# EasyEDA Pro project ProDocument_CSPS-ATX12VO-NAK12S20_2023-09-14.epro

# Schematic Schematic-NAK12S20
Create Date: 2023-08-24; Page Name: P1; Project Name: CSPS_DCATX; Schematic Name: Schematic-NAK12S20; Update Date: 2023-08-29; Page Size: A3; Version: V1.0
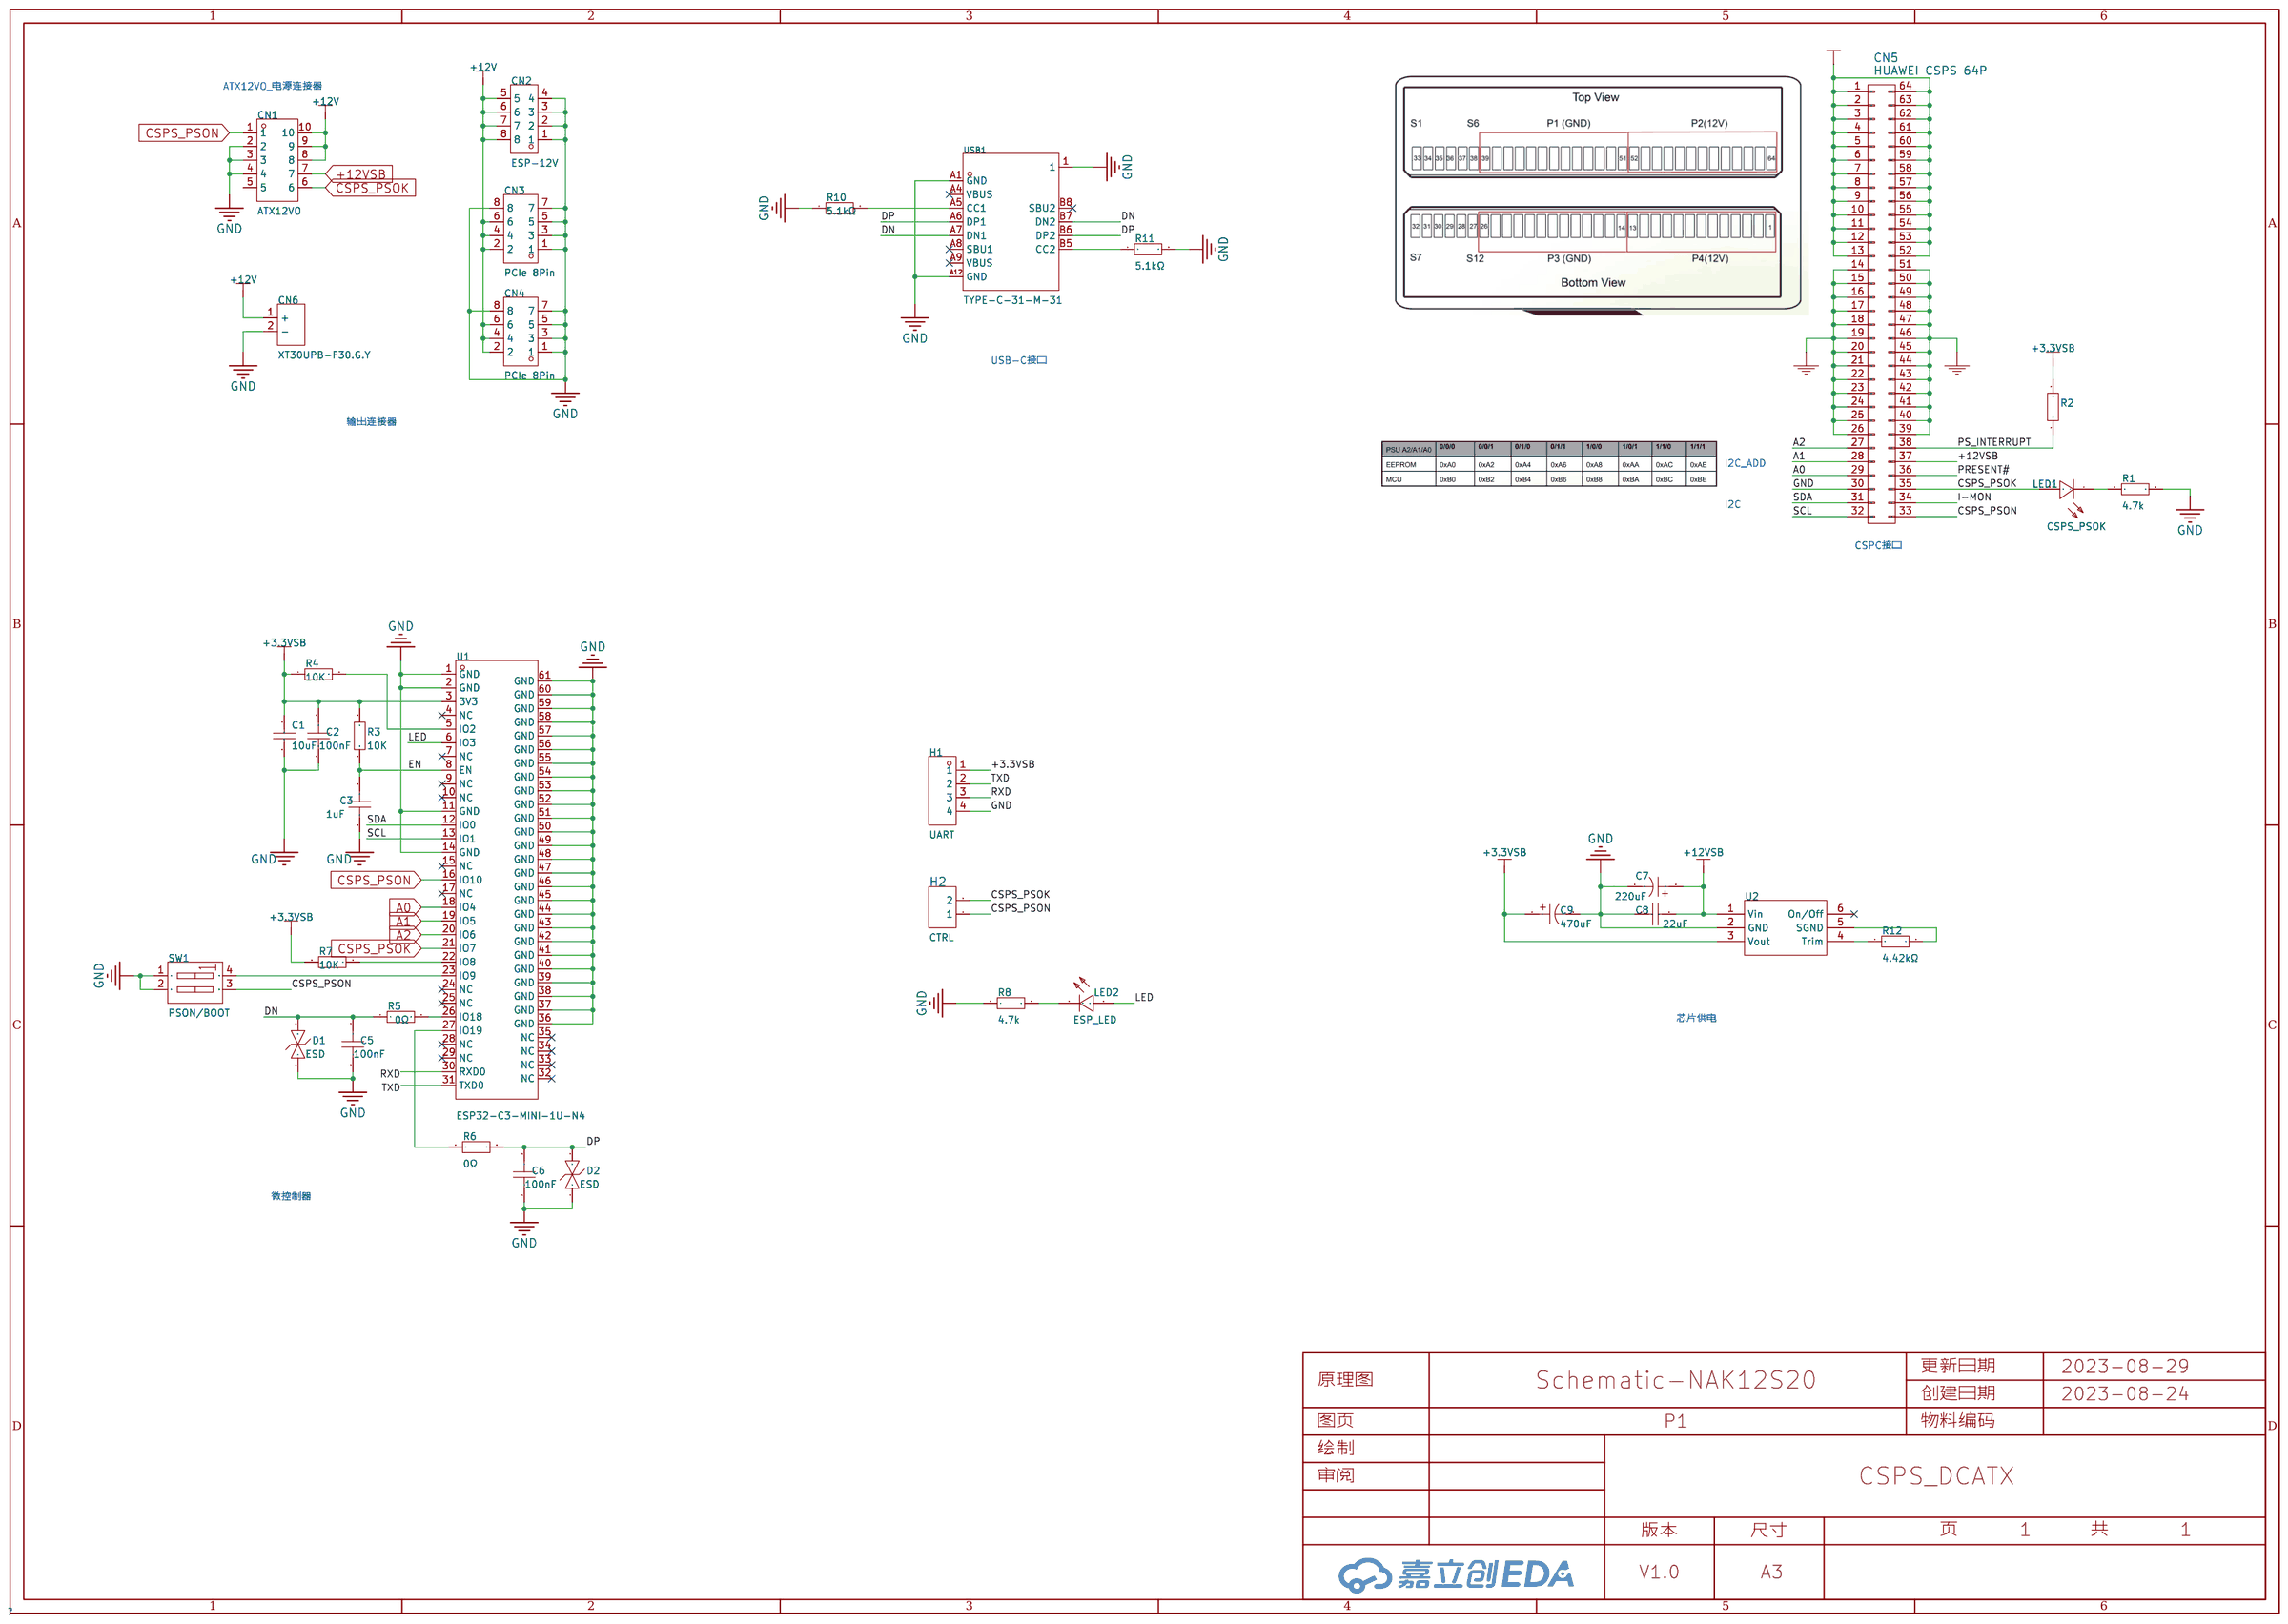
[diagram p0: schematic sheet]

## Parts
C1  10uF  [C0805]
C2  100nF  [C0603]
C3  1uF  [C0603]
C5  100nF  [C0603]
C6  100nF  [C0603]
C7  220uF  [CAP-SMD_BD6.3-L6.6-W6.6-FD]
C8  22uF  [C1206]
C9  470uF  [CAP-SMD_BD8.0-L8.3-W8.3-LS9.0-FD]
CN1  ATX12VO  [CONN-TH_X9357WV-2-05-N2SN]
CN2  ESP-12V  [CONN-TH_39288080]
CN3  PCIe 8Pin  [CONN-TH_8P-P4.20_CST_CS-1150-08D]
CN4  PCIe 8Pin  [CONN-TH_8P-P4.20_CST_CS-1150-08D]
CN5  HUAWEI CSPS 64P  [ATX 64P HP 野口64P直插]
CN6  XT30UPB-F30.G.Y  [CONN-TH_XT30UPB-F]
D1  ESD  [SOD-882_L1.0-W0.6-BI]
D2  ESD  [SOD-882_L1.0-W0.6-BI]
H1  UART  [HDR-TH_4P-P2.54-V-F]
H2  CTRL  [HDR-TH_2P-P2.54-V-F]
LED1  CSPS_PSOK  [LED0603-RD_GREEN]
LED2  ESP_LED  [LED0603-RD]
R1  4.7k  [R0603]
R2  4.7k  [R0603]
R3  10K  [R0603]
R4  10K  [R0603]
R5  0Ω  [R0603]
R6  0Ω  [R0603]
R7  10K  [R0603]
R8  4.7k  [R0603]
R10  5.1kΩ  [R0603]
R11  5.1kΩ  [R0603]
R12  4.42kΩ  [R0603]
SW1  PSON/BOOT  [SW-SMD_4P-L6.0-W5.1-P2.54-LS9.3-BL]
U1  ESP32-C3-MINI-1U-N4  [WIFIM-SMD_61P-L13.2-W12.5-P0.80]
U2  -  [NAK12S20-C]
USB1  TYPE-C-31-M-31  [USB-C-SMD_TYPE-C-31-M-31]

## Library data of the parts
C1 = CL21A106KAYNNNE_C15850: 容值:10uF;精度:±10%;额定电压:25V;材质(温度系数):X5R;; LCSC Part Name: 10uF ±10% 25V; Supplier Part: C15850; Manufacturer: SAMSUNG(三星); Manufacturer Part: CL21A106KAYNNNE; Supplier Footprint: 0805; JLCPCB Part Class: 基础库; Datasheet: https://atta.szlcsc.com/upload/public/pdf/source/20160103/1457707679302.pdf; Supplier: LCSC; Tolerance: ±10%; Voltage Rated: 25V; Temperature Coefficient: X5R
C2 C3 C5 C6 = CAP_0603: Supplier Footprint: 0603
C7 = RVT220UF16V67RV0015: 容值:220uF;精度:±20%;额定电压:16V;纹波电流:110mA@120Hz;等效串联电阻:-;; LCSC Part Name: 220uF ±20% 16V; Supplier Part: C2887273; Manufacturer: KNSCHA(科尼盛); Supplier Footprint: SMD,D6.3xL7.7mm; JLCPCB Part Class: 扩展库; Datasheet: https://atta.szlcsc.com/upload/public/pdf/source/20210824/3DC9999D9B098FE241E3A26137981C4C.pdf; Supplier: LCSC; Tolerance: ±20%; Rated Voltage: 16V; φD: 6.3mm; L: 7.7mm; Ripple Current: 110mA@120Hz; Lifetime @ Temp: 2000hrs@105℃; Operating Temperature: -55℃~+105℃
C8 = CL31A226KAHNNNE: 容值:22uF;精度:±10%;额定电压:25V;材质(温度系数):X5R;; LCSC Part Name: 22uF ±10% 25V; Supplier Part: C12891; Manufacturer: SAMSUNG(三星); Supplier Footprint: 1206; JLCPCB Part Class: 基础库; Datasheet: https://atta.szlcsc.com/upload/public/pdf/source/20160103/1457707667836.pdf; Supplier: LCSC; Tolerance: ±10%; Voltage Rated: 25V; Temperature Coefficient: X5R
C9 = RVT470UF16V67RV0031: 容值:470uF;额定电压:16V;工作寿命:2000hrs@105℃;; LCSC Part Name: 470uF 16V; Supplier Part: C2858857; Manufacturer: KNSCHA(科尼盛); Supplier Footprint: SMD,8x10.2mm; JLCPCB Part Class: 扩展库; Supplier: LCSC; Rated Voltage: 16V; Lifetime @ Temp: 2000hrs@105℃
CN1 = X9357WV-2x05-N2SN: 参考系列:-;间距:4.2mm;插针结构:2x5P;排数:2;每排PIN数:5;行距:4.2mm;公母:母型插口;安装方式:直插;额定电流:9A;触头材质:黄铜;触头镀层:锡;工作温度范围:-25℃~+85℃;焊接温度(最大值):260℃;; LCSC Part Name: 4.2mm 2x5P 直插; Supplier Part: C388774; Manufacturer: XKB Connectivity(中国星坤); Supplier Footprint: 插件,P=4.2mm; JLCPCB Part Class: 扩展库; Datasheet: https://atta.szlcsc.com/upload/public/pdf/source/20200618/C388780_3940A936C4431515C5C8B4FDD63262F5.pdf; Supplier: LCSC; Pitch: 4.2mm; Pins Structure: 2x5P; Number of Rows: 2; Number of PINs Per Row: 5; Row Spacing: 4.2mm; Gender: 母型插口; Mounting Style: 直插; Current Rating (Max): 9A; Contact Material: 黄铜; Contact Plating: 锡; Operating Temperature Range: -25℃~+85℃; Welding Temperature (Max): 260℃
CN2 = 39288080: 参考系列:-;间距:4.2mm;插针结构:2x4P;排数:2;每排PIN数:4;行距:4.2mm;公母:母型插口;安装方式:直插;额定电流:-;工作温度范围:-;; LCSC Part Name: 4.2mm 2x4P 直插; Supplier Part: C505059; Manufacturer: MOLEX; Supplier Footprint: 直插,P=4.2mm; JLCPCB Part Class: 扩展库; Datasheet: https://atta.szlcsc.com/upload/public/pdf/source/20200305/C490534_56FFF6A75141AEB9881ADC289DCEF44C.pdf; Supplier: LCSC; Pitch: 4.2mm; Pins Structure: 2x4P; Number of Rows: 2; Number of PINs Per Row: 4; Row Spacing: 4.2mm; Gender: 母型插口; Mounting Style: 直插
CN3 CN4 = CS-1150-08D: 参考系列:-;间距:4.2mm;插针结构:2x4P;排数:2;每排PIN数:4;行距:4.2mm;公母:母型插口;安装方式:直插;额定电流:7A;工作温度范围:-40℃~+105℃;; LCSC Part Name: 4.2mm 2x4P 直插; Supplier Part: C2886679; Manufacturer: CST(永丰盈); Supplier Footprint: 插件,P=4.2mm; JLCPCB Part Class: 扩展库; Datasheet: https://atta.szlcsc.com/upload/public/pdf/source/20210907/CA36E0C11B96594AB63D77B45F584706.pdf; Supplier: LCSC; Pitch: 4.2mm; Pins Structure: 2x4P; Number of Rows: 2; Number of PINs Per Row: 4; Row Spacing: 4.2mm; Gender: 母型插口; Mounting Style: 直插; Current Rating (Max): 7A; Operating Temperature Range: -40℃~+105℃
CN5 = HP CSPS ATX 64P
CN6 = XT30UPB-F30.G.Y: 模型插头连接器; LCSC Part Name: AMASS(艾迈斯)直立焊板式连接器XT30UPB30-F.G.*; Supplier Part: C108769; Manufacturer: AMASS(艾迈斯); JLCPCB Part Class: 扩展库; Datasheet: https://atta.szlcsc.com/upload/public/pdf/source/20220715/AFD68B9E8B6CA95A7295DBF4AF9325E4.pdf; Supplier: LCSC
D1 D2 = ESD05V88D-LC: 极性:-;反向关断电压（典型值）:5V (Max);击穿电压（最小值）:6V;箝位电压:25V;峰值脉冲电流（10/1000us）:2.5A (8/20us);; Supplier Part: C303803; Manufacturer: SOCAY(硕凯); Supplier Footprint: SOD-882; JLCPCB Part Class: 扩展库; Datasheet: https://atta.szlcsc.com/upload/public/pdf/source/20190214/C303803_4EC156DA2EEF4DE29273DF707B47A120.pdf; Supplier: LCSC; Voltage - Reverse Standoff (Typ): 5V (Max); Voltage - Breakdown (Min): 6V; Voltage - Clamping (Max) @ Ipp: 25V; Current - Peak Pulse (10/1000μs): 2.5A (8/20us)
H1 = HDR-F_2.54_1x4P: Supplier Part: C2718488; Supplier Footprint: 插件
H2 = HDR-F_2.54_1x2P: Supplier Part: C49661; Supplier Footprint: 插件
LED1 = LED-0603G-FZ_GREEN: Supplier Part: C9900007571; Supplier Footprint: LED0603; JLCPCB Part Class: 扩展库; Datasheet: 2022-02-15/306503D/4f9af1fa6f7443e0a55b55c7ec05d279/D-060306G2／SS2／G.pdf; Supplier: LCSC
LED2 = 19-217/GHC-YR1S2/3T: 发光颜色:翠绿;二极管配置:-;主波长:520nm~535nm;色温:-;功率:110mW;安装方式:-;; Supplier Part: C72043; Manufacturer: EVERLIGHT(亿光); Supplier Footprint: 0603; JLCPCB Part Class: 基础库; Datasheet: https://atta.szlcsc.com/upload/public/pdf/source/20160507/1462613613780.pdf; Supplier: LCSC; Emitted Color: 翠绿; Lens Color: 无色透明; Dominant Wavelength: 520nm~535nm; Peak Wavelength: 518nm; Forward Current: 20mA; Power Dissipation: 110mW; Viewing Angle: 120°; Operating Temperature: -40℃~+85℃
R1-R4 R7 R8 = Res_0603: Supplier Footprint: 0603
R5 R6 = 0603WAF0000T5E: 电阻类型:厚膜电阻;阻值:0Ω;精度:±1%;功率:100mW;; LCSC Part Name: 0Ω ±1% 100mW; Supplier Part: C21189; Manufacturer: UNI-ROYAL(厚声); Supplier Footprint: 0603; JLCPCB Part Class: 基础库; Datasheet: https://atta.szlcsc.com/upload/public/pdf/source/20200306/C422600_1E6D84923E4A46A82E41ADD87F860B5C.pdf; Supplier: LCSC; Type: 厚膜电阻; Tolerance: ±1%; Power(Watts): 100mW; Overload Voltage (Max): 75V; Operating Temperature Range: -55℃~+155℃
R10 R11 = 0603WAF5101T5E: 电阻类型:厚膜电阻;阻值:5.1kΩ;精度:±1%;功率:100mW;; LCSC Part Name: 5.1kΩ ±1% 100mW; Supplier Part: C23186; Manufacturer: UNI-ROYAL(厚声); Supplier Footprint: 0603; JLCPCB Part Class: 基础库; Datasheet: https://atta.szlcsc.com/upload/public/pdf/source/20200306/C422600_1E6D84923E4A46A82E41ADD87F860B5C.pdf; Supplier: LCSC; Type: 厚膜电阻; Tolerance: ±1%; Power(Watts): 100mW; Temperature Coefficient: ±100ppm/℃; Overload Voltage (Max): 75V; Operating Temperature Range: -55℃~+155℃
R12 = 0603WAF4421T5E: 电阻类型:厚膜电阻;阻值:4.42kΩ;精度:±1%;功率:100mW;; LCSC Part Name: 4.42kΩ ±1% 100mW; Supplier Part: C23043; Manufacturer: UNI-ROYAL(厚声); Supplier Footprint: 0603; JLCPCB Part Class: 扩展库; Datasheet: https://atta.szlcsc.com/upload/public/pdf/source/20200306/C422600_1E6D84923E4A46A82E41ADD87F860B5C.pdf; Supplier: LCSC; Type: 厚膜电阻; Tolerance: ±1%; Power(Watts): 100mW; Temperature Coefficient: ±100ppm/℃; Overload Voltage (Max): 75V; Operating Temperature Range: -55℃~+155℃
SW1 = DSIC02LSGET: 类型:平拨，凸起式;电路结构:单刀单掷;开关位数:2;引脚间距:2.54mm;颜色:黑色;; LCSC Part Name: 2.54mm 2位高推 拨码开关; Supplier Part: C54949; Manufacturer: YE; Supplier Footprint: SMD-4P,6x5.08mm; JLCPCB Part Class: 扩展库; Datasheet: https://atta.szlcsc.com/upload/public/pdf/source/20150928/1457707425489.pdf; Supplier: LCSC; Type: 平拨，凸起式; Circuit: 单刀单掷; Number of Positions: 2; Lead Pitch: 2.54mm; Color: 黑色
U1 = ESP32-C3-MINI-1U-N4: Supplier Part: C2911374; Manufacturer: ESPRESSIF(乐鑫); Supplier Footprint: SMD,12.5x13.2mm; JLCPCB Part Class: 扩展库; Datasheet: https://atta.szlcsc.com/upload/public/pdf/source/20220602/2F3F799AD033675D9930B69B0B580EA8.pdf; Supplier: LCSC
U2 = NAK12S20-C: 华为降压模块; Manufacturer: HUAWEI; Frequency: 300kHz
USB1 = TYPE-C-31-M-31: 连接器类型:Type-C;标准:-;公母:母座;触点数量:16;端口数量:1;安装方式:卧贴;额定电流 - 电源:5A;工作温度范围:-30℃~+80℃;; LCSC Part Name: Type-C 母座 卧贴; Supplier Part: C2760486; Manufacturer: 韩国韩荣; Supplier Footprint: SMD; JLCPCB Part Class: 扩展库; Supplier: LCSC; Connector Type: Type-C; Gender: 母座; Number of Contacts: 16; Number of Ports: 1; Mounting Style: 卧贴; Current Rating - Power (Max): 5A; Operating Temperature Range: -30℃~+80℃

## Nets
+3.3VSB: C1.2 C2.2 C9.1 H1.1 R2.2 R3.2 R4.1 R7.1 U1.3(3V3) U2.3(Vout)
+12V: CN1.8 CN1.9 CN1.10 CN2.5 CN2.6 CN2.7 CN2.8 CN3.2 CN3.4 CN3.6 CN4.2 CN4.4 CN4.6 CN5.1(Pin) CN5.2(Pin) CN5.3(Pin) CN5.4(Pin) CN5.5(Pin) CN5.6(Pin) CN5.7(Pin) CN5.8(Pin) CN5.9(Pin) CN5.10(Pin) CN5.11(Pin) CN5.12(Pin) CN5.13(Pin) CN5.52(Pin) CN5.53(Pin) CN5.54(Pin) CN5.55(Pin) CN5.56(Pin) CN5.57(Pin) CN5.58(Pin) CN5.59(Pin) CN5.60(Pin) CN5.61(Pin) CN5.62(Pin) CN5.63(Pin) CN5.64(Pin) CN6.1(+)
+12VSB: C7.1 C8.2 CN1.7 CN5.37(+12VSB) U2.1(Vin)
GND: C1.1 C2.1 C3.1 C5.1 C6.1 C7.2 C8.1 C9.2 CN1.2 CN1.3 CN1.4 CN2.1 CN2.2 CN2.3 CN2.4 CN3.1 CN3.3 CN3.5 CN3.7 CN3.8 CN4.1 CN4.3 CN4.5 CN4.7 CN4.8 CN5.14(Pin) CN5.15(Pin) CN5.16(Pin) CN5.17(Pin) CN5.18(Pin) CN5.19(Pin) CN5.20(Pin) CN5.21(Pin) CN5.22(Pin) CN5.23(Pin) CN5.24(Pin) CN5.25(Pin) CN5.26(Pin) CN5.30(CSPS-PSOK) CN5.39(Pin) CN5.40(Pin) CN5.41(Pin) CN5.42(Pin) CN5.43(Pin) CN5.44(Pin) CN5.45(Pin) CN5.46(Pin) CN5.47(Pin) CN5.48(Pin) CN5.49(Pin) CN5.50(Pin) CN5.51(Pin) CN6.2(-) D1.1 D2.1 H1.4 R1.2 R8.1 R10.1 R11.2 SW1.1(A1) SW1.2(A2) U1.1(GND) U1.2(GND) U1.11(GND) U1.14(GND) U1.36(GND) U1.37(GND) U1.38(GND) U1.39(GND) U1.40(GND) U1.41(GND) U1.42(GND) U1.43(GND) U1.44(GND) U1.45(GND) U1.46(GND) U1.47(GND) U1.48(GND) U1.49(GND) U1.50(GND) U1.51(GND) U1.52(GND) U1.53(GND) U1.54(GND) U1.55(GND) U1.56(GND) U1.57(GND) U1.58(GND) U1.59(GND) U1.60(GND) U1.61(GND) U2.2(GND) USB1.1 USB1.A1(GND) USB1.A12(GND)
A0: CN5.29(PRESENT) U1.18(IO4)
A1: CN5.28(+12VSB) U1.19(IO5)
A2: CN5.27(PWOK) U1.20(IO6)
CSPS_PSOK: CN1.6 CN5.35(I2C-GND) H2.2 LED1.2(+) U1.21(IO7)
CSPS_PSON: CN1.1 CN5.33(scl) H2.1 SW1.3(B2) U1.16(IO10)
DN: C5.2 D1.2 R5.1 USB1.A7(DN1) USB1.B7(DN2)
DP: C6.2 D2.2 R6.2 USB1.A6(DP1) USB1.B6(DP2)
EN: C3.2 R3.1 U1.8(EN)
I-MON: CN5.34(sda)
LED: LED2.2(A) U1.6(IO3)
PRESENT#: CN5.36(PRESENT)
PS_INTERRUPT: CN5.38(pin) R2.1
RXD: H1.3 U1.30(RXD0)
SCL: CN5.32(CSPS-PSON) U1.13(IO1)
SDA: CN5.31(Pin) U1.12(IO0)
TXD: H1.2 U1.31(TXD0)
$1N1591: LED1.1(-) R1.1
$1N2923: R4.2 U1.5(IO2)
$1N3210: R5.2 U1.26(IO18)
$1N3353: R7.2 U1.22(IO8)
$1N3418: SW1.4(B1) U1.23(IO9)
$1N4889: LED2.1(C) R8.2
$1N5330: R10.2 USB1.A5(CC1)
$1N5590: R11.1 USB1.B5(CC2)
$1N6425: R6.1 U1.27(IO19)
$1N20449: R12.1 U2.4(Trim)
$1N20452: R12.2 U2.5(SGND)

Not connected (* = marked no-connect by the designer): CN1 5; U1 4(NC)* 7(NC)* 9(NC)* 10(NC)* 15(NC)* 17(NC)* 24(NC)* 25(NC)* 28(NC)* 29(NC)* 32(NC)* 33(NC)* 34(NC)* 35(NC)*; U2 6(On/Off)*; USB1 A4(VBUS)* A8(SBU1)* A9(VBUS)* B8(SBU2)*

## Notes on the sheet
- ATX12VO_电源连接器
- USB-C接口
- 输出连接器
- I2C_ADD
- I2C
- CSPC接口
- 芯片供电
- 微控制器

# Board PCB-NAK12S20
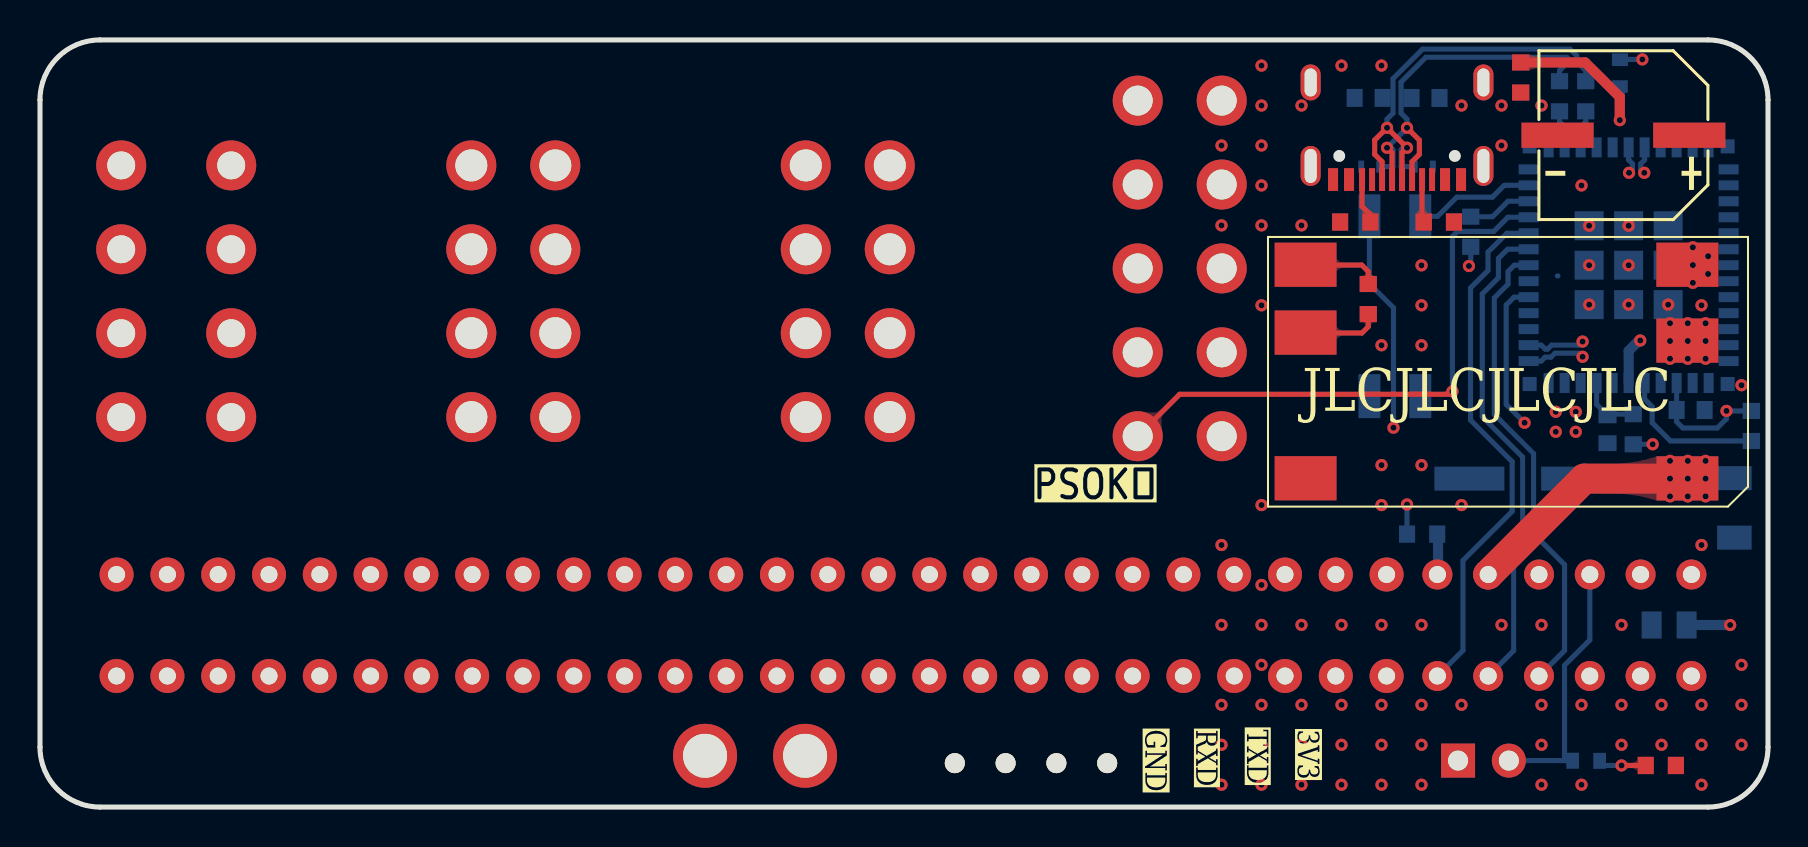
[diagram p1: board, top side]
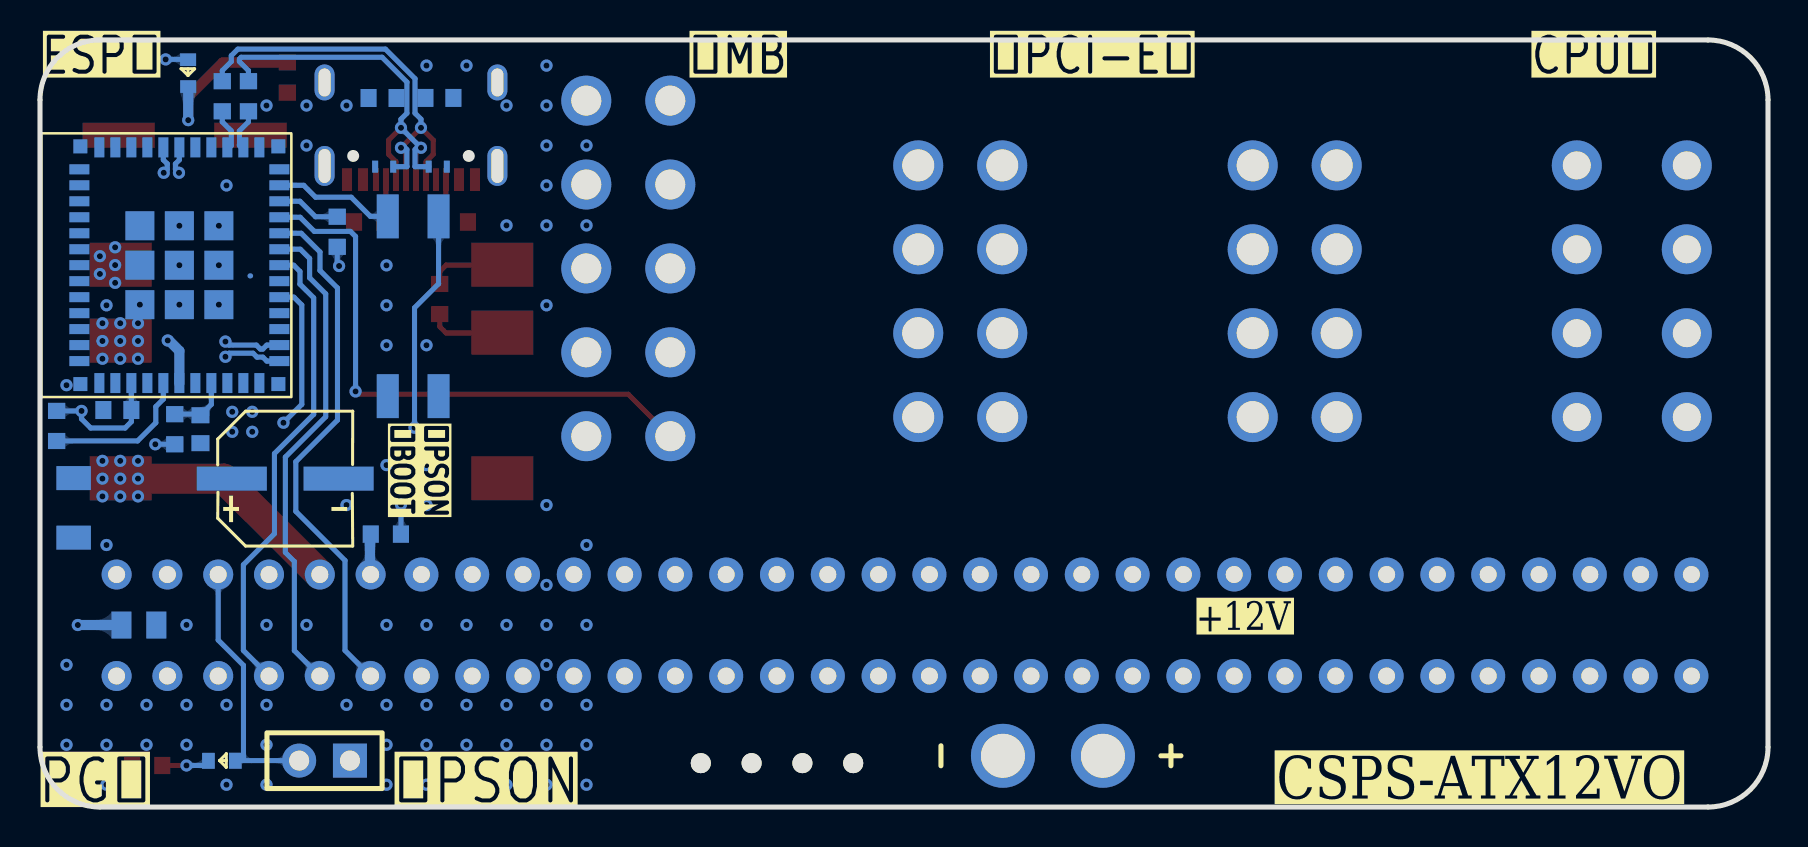
[diagram p2: board, bottom side, seen from below]

Outline 86.4 x 38.4 mm; copper layers: Top Layer, Inner2, Inner3, Bottom Layer. Coordinates in mm from the lower left corner of the outline.
Outline path: 0,35.4 0,3 arc(0.88,0.88) 3,0 83.4,0 arc(85.52,0.88) 86.4,3 86.4,35.4 arc(85.52,37.52) 83.4,38.4 3,38.4 arc(0.88,37.52) 0,35.4
Stack: Top Layer 0.035mm 外层铜厚1oz / Dielectric1 0.48mm 7628 RC49% 8.6mil / Inner2 0.035mm 内层铜厚 / Dielectric2 0.48mm 1.1mm H/HOZ 含铜 / Inner3 0.035mm - / Dielectric3 0.48mm 7628 RC49% 8.6mil / Bottom Layer 0.035mm 外层铜厚1oz

## Design rules (mm)
net SDA: DP1
net SCL: DP1
net TXD: DP3
net RXD: DP3
net $1N3210: DP2
net $1N6425: DP2
net DP: DP4
net DN: DP4
template: 自定义配置
spacing copperThickness1oz (default): track to track 0.102, other pairs 0.152 to 0.3
spacing copperThickness2oz: track to track 0.203, other pairs 0.152 to 0.3
track width copperThickness1oz (default): min 0.127, default 0.254, max 2.54
track width copperThickness2oz: min 0.203, default 0.254, max 2.54
differential pair differentialPair (default): width min 0.127, default 0.254, max 2.54; gap min 0.152, default 0.152
via viaSize (default): diameter min 0.5, default 0.61, max 10; hole min 0.3, default 0.305, max 6.3

## Placement (name value [footprint] x y rotation side)
C1  10uF  [C0805]  81.46 9.11 0 bottom
C2  100nF  [C0603]  82.53 19.87 180 bottom
C3  1uF  [C0603]  78.38 18.91 90 bottom
C5  100nF  [C0603]  69.27 35.49 180 bottom
C6  100nF  [C0603]  66.43 35.5 0 bottom
C7  220uF  [CAP-SMD_BD6.3-L6.6-W6.6-FD]  74.14 16.44 180 bottom
C8  22uF  [C1206]  84.72 14.98 90 bottom
C9  470uF  [CAP-SMD_BD8.0-L8.3-W8.3-LS9.0-FD]  79.17 33.63 180 top
CN1  ATX12VO  [CONN-TH_X9357WV-2-05-N2SN]  56.99 26.96 90 bottom
CN2  ESP-12V  [CONN-TH_39288080]  6.81 25.82 270 bottom
CN3  PCIe 8Pin  [CONN-TH_8P-P4.20_CST_CS-1150-08D]  23.66 25.82 90 bottom
CN4  PCIe 8Pin  [CONN-TH_8P-P4.20_CST_CS-1150-08D]  40.39 25.82 90 bottom
CN5  HUAWEI CSPS 64P  [ATX 64P HP 野口64P直插]  43.2 9.1 0 top
CN6  XT30UPB-F30.G.Y  [CONN-TH_XT30UPB-F]  35.75 2.57 0 bottom
D1  ESD  [SOD-882_L1.0-W0.6-BI]  66.51 32.06 0 bottom
D2  ESD  [SOD-882_L1.0-W0.6-BI]  69.19 32.06 180 bottom
H1  UART  [HDR-TH_4P-P2.54-V-F]  49.55 2.2 180 top
H2  CTRL  [HDR-TH_2P-P2.54-V-F]  72.17 2.33 0 bottom
LED1  CSPS_PSOK  [LED0603-RD_GREEN]  77.31 2.31 180 bottom
LED2  ESP_LED  [LED0603-RD]  78.99 36.74 90 bottom
R1  4.7k  [R0603]  81.04 2.08 0 top
R2  4.7k  [R0603]  69.11 13.66 180 bottom
R3  10K  [R0603]  79.66 18.91 270 bottom
R4  10K  [R0603]  85.57 19.08 270 bottom
R5  0Ω  [R0603]  75.98 35.58 270 bottom
R6  0Ω  [R0603]  77.29 35.58 90 bottom
R7  10K  [R0603]  71.54 28.8 90 bottom
R8  4.7k  [R0603]  74.04 36.52 90 top
R10  5.1kΩ  [R0603]  69.94 29.29 180 top
R11  5.1kΩ  [R0603]  65.76 29.29 180 top
R12  4.42kΩ  [R0603]  66.41 25.43 270 top
SW1  PSON/BOOT  [SW-SMD_4P-L6.0-W5.1-P2.54-LS9.3-BL]  67.74 25.07 180 bottom
U1  ESP32-C3-MINI-1U-N4  [WIFIM-SMD_61P-L13.2-W12.5-P0.80]  79.43 27.12 90 bottom
U2  -  [NAK12S20-C]  73.4 21.79 180 top
USB1  TYPE-C-31-M-31  [USB-C-SMD_TYPE-C-31-M-31]  67.85 33.9 180 top

## Footprints (pads in the part's own frame, mm; a bottom-side part is the same pattern mirrored in y, then rotated)
ATX 64P HP 野口64P直插
  round 1.7 hole 0.85: 1(-39.37,-2.54) 2(-36.83,-2.54) 3(-34.29,-2.54) 4(-31.75,-2.54) 5(-29.21,-2.54) 6(-26.67,-2.54) 7(-24.13,-2.54) 8(-21.59,-2.54) 9(-19.05,-2.54) 10(-16.51,-2.54) 11(-13.97,-2.54) 12(-11.43,-2.54) 13(-8.89,-2.54) 14(-6.35,-2.54) 15(-3.81,-2.54) 16(-1.27,-2.54) 17(1.27,-2.54) 18(3.81,-2.54) 19(6.35,-2.54) 20(8.89,-2.54) 21(11.43,-2.54) 22(13.97,-2.54) 23(16.51,-2.54) 24(19.05,-2.54) 25(21.59,-2.54) 26(24.13,-2.54) 39(24.13,2.54) 40(21.59,2.54) 41(19.05,2.54) 42(16.51,2.54) 43(13.97,2.54) 44(11.43,2.54) 45(8.89,2.54) 46(6.35,2.54) 47(3.81,2.54) 48(1.27,2.54) 49(-1.27,2.54) 50(-3.81,2.54) 51(-6.35,2.54) 52(-8.89,2.54) 53(-11.43,2.54) 54(-13.97,2.54) 55(-16.51,2.54) 56(-19.05,2.54) 57(-21.59,2.54) 58(-24.13,2.54) 59(-26.67,2.54) 60(-29.21,2.54) 61(-31.75,2.54) 62(-34.29,2.54) 63(-36.83,2.54) 64(-39.37,2.54)
  round 1.5 hole 0.85: 27(26.67,-2.54) 28(29.21,-2.54) 29(31.75,-2.54) 30(34.29,-2.54) 31(36.83,-2.54) 32(39.37,-2.54) 33(39.37,2.54) 34(36.83,2.54) 35(34.29,2.54) 36(31.75,2.54) 37(29.21,2.54) 38(26.67,2.54)
C0603
  rect 0.8x0.9 smd: 1(-0.7,0) 2(0.7,0)
C0805
  rect 1x1.35 smd: 1(-0.873,0) 2(0.873,0)
C1206
  rect 1.2x1.728 smd: 1(-1.491,0) 2(1.491,0)
CAP-SMD_BD6.3-L6.6-W6.6-FD
  rect 3.5x1.2 smd: 1(-2.67,0) 2(2.67,0)
CAP-SMD_BD8.0-L8.3-W8.3-LS9.0-FD
  rect 3.61x1.26 smd: 1(-3.295,0) 2(3.295,0)
CONN-TH_8P-P4.20_CST_CS-1150-08D
  round 2.5 hole 1.6: 1(-6.3,-2.1) 2(-6.3,2.1) 3(-2.1,-2.1) 4(-2.1,2.1) 5(2.1,-2.1) 6(2.1,2.1) 7(6.3,-2.1) 8(6.3,2.1)
CONN-TH_39288080
  round 2.5 hole 1.4: 1(6.3,-2.75) 2(2.1,-2.75) 3(-2.1,-2.75) 4(-6.3,-2.75) 5(6.3,2.75) 6(2.1,2.75) 7(-2.1,2.75) 8(-6.3,2.75)
CONN-TH_X9357WV-2-05-N2SN
  round 2.5 hole 1.5: 1(-8.4,2.1) 2(-4.2,2.1) 3(0,2.1) 4(4.2,2.1) 5(8.4,2.1) 6(-8.4,-2.1) 7(-4.2,-2.1) 8(0,-2.1) 9(4.2,-2.1) 10(8.4,-2.1)
CONN-TH_XT30UPB-F
  round 3.2 hole 2.2: 1(-2.5,0) 2(2.5,0)
HDR-TH_2P-P2.54-V-F
  rect 1.7x1.7 hole 1: 1(-1.27,0)
  round 1.7 hole 1: 2(1.27,0)
HDR-TH_4P-P2.54-V-F
  round 1 hole 1.1x0.6: 1(-3.81,0) 2(-1.27,0) 3(1.27,0) 4(3.81,0)
LED0603-RD
  rect 0.635x0.8 smd: 1(-0.672,-0.004) 2(0.672,0.004)
LED0603-RD_GREEN
  rect 0.635x0.8 smd: 1(-0.673,-0.003) 2(0.673,0.003)
NAK12S20-C
  custom 3.1x2.21 smd: 1(-8.97,5.34) 2(-8.97,-1.56) 3(-8.97,-5.36) 4(10.12,-5.36) 5(10.12,-1.96) 6(10.12,5.33)
R0603
  rect 0.806x0.864 smd: 1(-0.753,0) 2(0.753,0)
SOD-882_L1.0-W0.6-BI
  rect 0.3x0.6 smd: 1(-0.452,0) 2(0.452,0)
SW-SMD_4P-L6.0-W5.1-P2.54-LS9.3-BL
  rect 1.1x2.2 smd: 1(-1.27,-4.5) 2(1.27,-4.5) 3(1.27,4.5) 4(-1.27,4.5)
USB-C-SMD_TYPE-C-31-M-31
  oval 1x2 hole 0.6x1.7: 1(-4.32,1.806) 1(4.32,1.806)
  oval 1x1.8 hole 0.6x1.4: 1(-4.32,-2.374) 1(4.32,-2.374)
  rect 0.5x1.14 smd: A1(-3.2,2.487) A4(-2.4,2.487) A9(2.4,2.487) A12(3.2,2.487)
  rect 0.3x1.14 smd: A5(-1.25,2.487) A6(-0.25,2.487) A7(0.25,2.487) A8(1.25,2.489) B5(1.75,2.487) B6(0.75,2.487) B7(-0.75,2.487) B8(-1.75,2.489)
WIFIM-SMD_61P-L13.2-W12.5-P0.80
  rect 1x0.5 smd: 1(-5.9,4) 2(-5.9,3.2) 3(-5.9,2.4) 4(-5.9,1.6) 5(-5.9,0.8) 6(-5.9,0) 7(-5.9,-0.8) 8(-5.9,-1.6) 9(-5.9,-2.4) 10(-5.9,-3.2) 11(-5.9,-4) 25(5.9,-4) 26(5.9,-3.2) 27(5.9,-2.4) 28(5.9,-1.6) 29(5.9,-0.8) 30(5.9,0) 31(5.9,0.8) 32(5.9,1.6) 33(5.9,2.4) 34(5.9,3.2) 35(5.9,4)
  rect 0.5x1 smd: 12(-4.8,-5) 13(-4,-5) 14(-3.2,-5) 15(-2.4,-5) 16(-1.6,-5) 17(-0.8,-5) 18(0,-5) 19(0.8,-5) 20(1.6,-5) 21(2.4,-5) 22(3.2,-5) 23(4,-5) 24(4.8,-5) 36(4.8,5) 37(4,5) 38(3.2,5) 39(2.4,5) 40(1.6,5) 41(0.8,5) 42(0,5) 43(-0.8,5) 44(-1.6,5) 45(-2.4,5) 46(-3.2,5) 47(-4,5) 48(-4.8,5)
  rect 1.45x1.45 smd: 49(0,0) 54(-1.975,1.975) 55(0,1.975) 56(1.975,1.975) 57(1.975,0) 58(1.975,-1.975) 59(0,-1.975) 60(-1.975,-1.975) 61(-1.975,0)
  rect 0.7x0.7 smd: 50(5.95,4.95) 51(5.95,-4.95) 52(-5.95,-4.95) 53(-5.95,4.95)

## Nets
As in the schematic.

Pads without a net: CN1 5; U1 4 7 9 10 15 17 24 25 28 29 32 33 34 35; U2 6; USB1 A4 A8 A9 B8

## Via types
v1: diameter 0.61, hole 0.304, Top Layer to Bottom Layer, 75 vias
v2: diameter 0.61, hole 0.305, Top Layer to Bottom Layer, 54 vias

## Routing (per net, layer and track width the routed paths; a pad name or vN(x,y) marks a point on that pad's centre or on a via; arc(x,y) is an arc through that point)
+3.3VSB: length 12
  Bottom Layer w0.254: R3.2 v2(80.63,18.16) ; v2(71.45,27.08) 71.54,27.18 R7.1 ; U1.3 C2.2 81.83,19.29 82.15,18.97 83.87,18.97 84.32,19.43 v2(84.32,19.83) R4.1 ; v2(68.35,15.15) 68.35,13.66 R2.2
  Bottom Layer w0.508: v2(84.51,9.11) C1.2
  vias: v2(82.64,28.02) v2(82.64,27.13) v2(82.64,26.24) v2(83.41,27.57) v2(83.41,26.69)
+12VSB: length 36.3
  Top Layer w1.5: v2(82.39,16.44) v2(81.5,16.44) 77.21,16.44 CN5.37
  Inner2 w1.016: CN5.37 70.03,14.02 59.87,14.02 56.97,16.92 56.97,20.7 54.91,22.76 CN1.7
  vias: v2(81.5,17.33) v2(81.5,15.55) v2(82.39,17.33) v2(82.39,15.55) v2(83.28,17.33) v2(83.28,16.44) v2(83.28,15.55)
GND: length 0
  Bottom Layer w0.254: 75.9,26.59 75.87,26.59
  vias: v1(59.08,33.12) v1(59.08,29.12) v1(59.08,13.12) v1(59.08,9.12) v1(59.08,5.12) v1(59.08,3.12) v1(59.08,1.12) v1(61.08,37.12) v1(61.08,35.12) v1(61.08,33.12) v1(61.08,31.12) v1(61.08,29.12) v1(61.08,25.12) v1(61.08,15.12) v1(61.08,11.12) v1(61.08,9.12) v1(61.08,7.12) v1(61.08,5.12) v1(61.08,3.12) v1(61.08,1.12) v1(63.08,35.12) v1(63.08,29.12) v1(63.08,9.12) v1(63.08,5.12) v1(63.08,3.12) v1(63.08,1.12) v1(65.08,37.12) v1(65.08,9.12) v1(65.08,5.12) v1(65.08,3.12) v1(65.08,1.12) v1(67.08,37.12) v1(67.08,23.12) v1(67.08,17.12) v1(67.08,15.12) v1(67.08,9.12) v1(67.08,5.12) v1(67.08,3.12) v1(67.08,1.12) v1(69.08,27.12) v1(69.08,25.12) v1(69.08,23.12) v1(69.08,17.12) v1(69.08,9.12) v1(69.08,5.12) v1(69.08,3.12) v1(69.08,1.12) v1(71.08,35.12) v1(71.08,15.12) v1(71.08,5.12) v1(73.08,35.12) v1(73.08,33.12) v1(73.08,9.12) v1(75.08,35.12) v1(75.08,9.12) v1(75.08,5.12) v1(75.08,3.12) v1(75.08,1.12) v1(77.08,31.12) v1(77.08,5.12) v1(77.08,1.12) v1(79.08,9.12) v1(79.08,5.12) v1(79.08,3.12) v1(81.08,5.12) v1(81.08,3.12) v1(83.08,25.12) v1(83.08,13.12) v1(83.08,5.12) v1(83.08,3.12) v1(83.08,1.12) v1(85.08,21.12) v1(85.08,7.12) v1(85.08,5.12) v1(85.08,3.12) v2(75.79,19.79) v2(75.79,18.79) v2(76.79,19.79) v2(76.79,18.79) v2(77.46,29.1) v2(77.46,27.12) v2(77.46,25.15) v2(79.43,29.1) v2(79.43,27.12) v2(79.43,25.15) v2(81.41,25.15) v2(81.5,24.22) v2(81.5,23.33) v2(81.5,22.44) v2(82.39,24.22) v2(82.39,23.33) v2(82.39,22.44) v2(83.28,24.22) v2(83.28,23.33) v2(83.28,22.44)
A0: length 23.7
  Bottom Layer w0.254: U1.18 73.72,27.12 73.4,26.81 73.4,26.18 72.72,25.49 72.72,19.66 74.68,17.69 74.68,13.68 76.23,12.13 76.23,7.84 CN5.29
A1: length 24.5
  Bottom Layer w0.254: CN5.28 73.68,7.83 73.68,12.29 74.13,12.74 74.13,17.52 72.12,19.54 72.12,25.69 72.92,26.49 72.92,27.46 73.38,27.92 U1.19
A2: length 26.4
  Bottom Layer w0.254: CN5.27 71.15,7.84 71.15,12.34 73.61,14.8 73.61,17.29 71.53,19.37 71.53,25.98 72.4,26.86 72.4,27.78 73.34,28.72 U1.20
CSPS_PSOK: length 72.3
  Top Layer w0.254: v2(70.62,20.8) 70.48,20.66 56.99,20.66 CN1.6
  Inner2 w0.254: CN1.6 54.89,14.77 55.9,13.76 55.9,10.88 57.07,9.71 75.56,9.71 CN5.35
  Bottom Layer w0.254: v2(70.62,20.8) 70.62,28.56 70.88,28.81 72.68,28.81 73.39,29.52 U1.21 ; H2.2 76.29,2.33 76.23,2.38 76.23,7.09 77.49,8.36 CN5.35
CSPS_PSON: length 62.2
  Inner2 w0.254: H2.1 73.68,5.1 73.68,7.1 74.68,8.1 79.02,8.1 82.56,11.64 CN5.33 77.97,16.24 77.24,16.24 74.25,19.24 v2(74.23,19.24) 67.92,19.24 v2(67.67,18.99) 59.51,18.99 CN1.1
  Bottom Layer w0.254: U1.16 73.7,25.52 73.31,25.13 73.31,20.16 v2(74.23,19.24) ; SW1.3 66.47,26.19 67.67,24.99 v2(67.67,18.99)
DN: length 20.4
  Top Layer w0.254: 68.6,31.53 68.6,32.31 68.97,32.67 68.97,33.39 v2(68.35,34) ; 67.6,31.53 67.6,32.75 v2(67.35,33)
  Bottom Layer w0.254: R5.1 75.98,36.87 76.43,37.32 76.43,37.44 76.34,37.53 69.3,37.53 68.05,36.29 68.05,34.73 68.35,34.43 v2(68.35,34) v2(67.35,33) 67.56,33 67.65,32.91 67.65,32.06 67.65,32.06 D1.2
DP: length 21.7
  Top Layer w0.254: 68.1,31.53 68.1,32.75 v2(68.35,33) v2(67.35,34) 66.73,33.39 66.73,32.67 67.1,32.31 67.1,31.53
  Bottom Layer w0.254: D2.2 68.06,32.06 68.05,32.06 68.05,32.91 68.14,33 v2(68.35,33) ; v2(67.35,34) 67.35,34.43 67.65,34.73 67.65,36.46 69.13,37.94 76.51,37.94 76.84,37.61 76.84,37.32 77.29,36.87 R6.2
EN: length 3.1
  Bottom Layer w0.254: U1.8 77.83,20.16 C3.2 78.43,19.67 R3.1
LED: length 18.4
  Inner2 w0.508: v2(80.01,23.36) 80.42,23.76 80.42,30.03 81.03,30.64 81.03,35.64 80.12,36.55 v2(80.12,37.43)
  Bottom Layer w0.254: LED2.2 79.01,37.43 v2(80.12,37.43)
  Bottom Layer w0.508: v2(80.01,23.36) 79.95,23.36 79.43,22.83 U1.6
PS_INTERRUPT: length 2
  Bottom Layer w0.508: 69.9,13.63 69.9,11.67 CN5.38
RXD: length 60.3
  Inner2 w0.254: v2(79.45,31.75) 79.45,31.32 79.63,31.14 79.63,31.01 78.24,29.62 78.24,26.94 77.65,26.35 74.12,26.35 69.72,21.94 63.26,21.94 60.12,25.09 53,25.09 49.35,21.43 49.35,13.21 48.28,12.15 H1.3
  Bottom Layer w0.254: v2(79.45,31.75) 79.63,31.93 79.63,32.2 79.43,32.4 U1.30
SCL: length 25.9
  Inner2 w0.254: CN5.32 82.21,6.56 81.79,6.98 81.79,8.11 84.93,11.25 84.93,17.45 79.26,23.12 77.74,23.12 77.56,23.3 v2(77.13,23.3)
  Bottom Layer w0.254: U1.13 75.06,23.12 75.26,22.93 75.38,22.93 75.58,23.12 76.95,23.12 v2(77.13,23.3)
SDA: length 25.8
  Inner2 w0.254: CN5.31 81.01,6.56 81.1,6.65 81.1,7.99 84.53,11.42 84.53,17.28 79.09,22.72 77.74,22.72 77.56,22.54 v2(77.13,22.54)
  Bottom Layer w0.254: U1.12 75.06,22.32 75.26,22.52 75.55,22.52 75.75,22.72 76.95,22.72 v2(77.13,22.54)
TXD: length 60.3
  Inner2 w0.254: v2(80.21,31.75) 80.21,31.32 80.03,31.14 80.03,30.84 78.65,29.46 78.65,26.77 77.81,25.94 74.29,25.94 69.89,21.54 63.09,21.54 59.95,24.68 53.17,24.68 49.75,21.27 49.75,13.22 50.82,12.15 H1.2
  Bottom Layer w0.254: U1.31 80.23,32.4 80.03,32.2 80.03,31.93 v2(80.21,31.75)
$1N1591: length 2.2
  Top Layer w0.254: v2(79.08,2.08) 80.29,2.08
  Bottom Layer w0.254: 78.12,2.08 v2(79.08,2.08)
$1N2923: length 7.5
  Bottom Layer w0.254: R4.2 85.56,18.33 81.52,18.33 80.61,19.24 80.61,20.04 80.23,20.42 U1.5
$1N3210: length 2.1
  Bottom Layer w0.254: U1.26 76.34,33.02 76.43,33.11 76.43,33.85 75.98,34.3 R5.2
$1N3353: length 3.3
  Bottom Layer w0.254: U1.22 73.4,30.32 72.63,29.55 71.41,29.55
$1N3418: length 6.1
  Bottom Layer w0.254: U1.23 73.22,31.12 72.62,30.53 70.84,30.53 69.88,29.57 SW1.4
$1N4889: length 8.5
  Top Layer w0.508: R8.2 77.26,37.27 78.99,35.54 v2(78.99,34.39)
  Bottom Layer w0.508: v2(78.99,34.39) 78.99,36.07
$1N5330: length 2
  Top Layer w0.254: 69.04,29.5 69.1,29.57 69.1,31.53
$1N5590: length 2.3
  Top Layer w0.254: 66.1,31.53 66.1,30.07 66.67,29.5
$1N6425: length 2.1
  Bottom Layer w0.254: R6.1 77.29,34.3 76.84,33.85 76.84,33.11 76.93,33.02 U1.27
$1N20449: length 3.9
  Top Layer w0.254: 63.3,27.13 66.09,27.13 66.41,26.81 R12.1
$1N20452: length 3.9
  Top Layer w0.254: 63.3,23.73 66.1,23.73 66.41,24.05 R12.2

## Copper pours and planes (outline as drawn; the poured copper is in the pictures)
+3.3VSB on Top Layer: 80.6,40.07 88.97,40.07 88.97,25.91 80.6,25.91
+3.3VSB on Inner3: 0.26,38.14 86.14,38.14 86.14,0.26 0.26,0.26
+12V on Top Layer: -3.15,39.4 93.28,39.4 93.28,-0.8 -3.15,-0.8
+12VSB on Bottom Layer: 74.98,17.63 90.55,17.63 90.55,15.24 74.98,15.24
GND on Top Layer: 57.08,39.78 90.06,39.78 90.06,-2.88 57.08,-2.88
GND on Bottom Layer: -0.78,44.2 87.65,44.2 87.65,-6.35 -0.78,-6.35

Small or netless copper shapes (teardrops, artwork), in the pictures only: 24 on Top Layer, 60 on Bottom Layer, 20 on Inner2

## Text on the board
Bottom Silkscreen Layer: ⏴PSON / ⏴BOOT | +12V | ESP⏵ | ⏴MB | CPU⏷ | ⏷PCI-E⏷ | CSPS-ATX12VO | ⏴PSON | PG⏵
Top Silkscreen Layer: GND | TXD | 3V3 | RXD | PSOK⏶ | JLCJLCJLCJLC
